# Altium project PCB_Project.PrjPcb
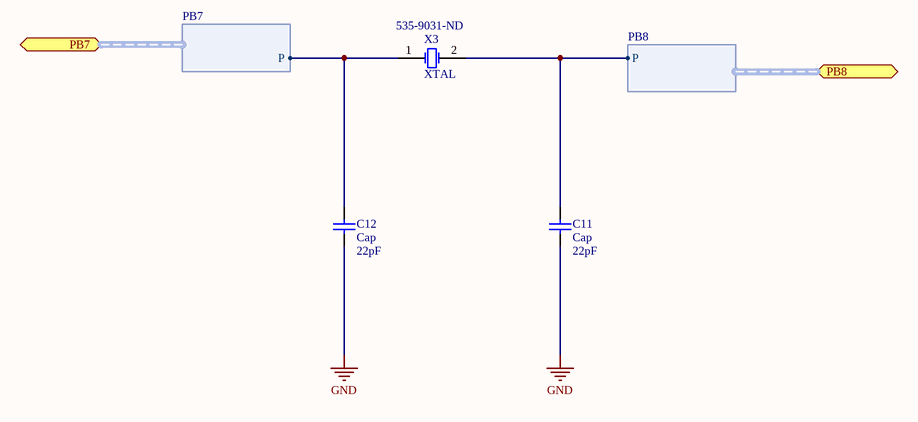
[diagram p0: crystal_oscillator_low_freq.SchDoc]
6 sheets, 32 parts. Net scope: flat (ports and power ports of the same name join across sheets).
Board files: PCB3.PcbDoc, PCB2.PcbDoc, PCB1.PcbDoc
Sheets:
  crystal_oscillator_low_freq.SchDoc
  crystal_oscillator_high_freq.SchDoc
  Power Supply.SchDoc
  USB.SchDoc
  Serial Wire Debug.SchDoc
  MCU.SchDoc

## Sheet crystal_oscillator_low_freq.SchDoc
size A4

### Parts
C11  Cap  value 22pF  [RAD-0.3]
C12  Cap  value 22pF  [RAD-0.3]
X3  XTAL  Supplier Part Number 1: 535-9031-ND  [R38]

### Ports
PB7 (harness PB7), PB8 (harness PB8)

### Harnesses
PB7: P
PB8: P

### Nets
GND: C11.1 C12.1
NetC11_2: C11.2 X3.2(OSC2) ; port PB8.P
NetC12_2: C12.2 X3.1(OSC1) ; port PB7.P

### Library data of the parts
C11 C12 = Cap: Capacitor; Published: 8-Jun-2000; LatestRevisionDate: 17-Jul-2002; LatestRevisionNote: Re-released for DXP Platform.; PackageReference: RAD-0.3; Publisher: Altium Limited; PackageDescription: Radial Cap, Thru-Hole; 2 Leads; 0.3 in Pin Spacing
X3 = XTAL: Crystal Oscillator; Manufacturer: Abracon Corporation; Manufacturer Part Number: AB15T-32.768KHZ; Description: CRYSTAL 32.768KHZ 12.5PF THRU; Frequency: 32.768kHz; Frequency Tolerance: ±20ppm; Load Capacitance: 12.5pF; ESR (Equivalent Series Resistance): 40 kOhm; Operating Mode: Fundamental; Published: 8-Jun-2000; LatestRevisionDate: 17-Jul-2002; LatestRevisionNote: Re-released for DXP Platform.; PackageReference: R38; Publisher: Altium Limited; PackageDescription: Crystal, Thru-Hole; 2 Leads; Body 3.1 x 8.2 mm (Dia.xH); Supplier 1: Digi-Key; RoHS: RoHS Compliant; Category: Crystals and Oscillators; Stock 1: 860; Pricing 1: 1=0.94, 10=0.896, 50=0.8754, 100=0.7504, 500=0.72958, 750=0.66704, 1000=0.61493, 2500=0.58366, 5000=0.56282 (EUR); Packaging: Bulk; Type: kHz Crystal (Tuning Fork); Frequency Stability: -; Operating Temperature: -20°C ~ 70°C; Ratings: -; Mounting Type: Through Hole; Package / Case: Cylindrical Can, Radial; Size / Dimension: 0.055" Dia x 0.197" L (1.40mm x 5.00mm); Height: 0.201" (5.10mm); ComponentLink1URL: http://www.abracon.com/Resonators/AB15T.pdf; ComponentLink1Description: http://www.abracon.com/Resonators/AB15T.pdf

## Sheet crystal_oscillator_high_freq.SchDoc
size A4
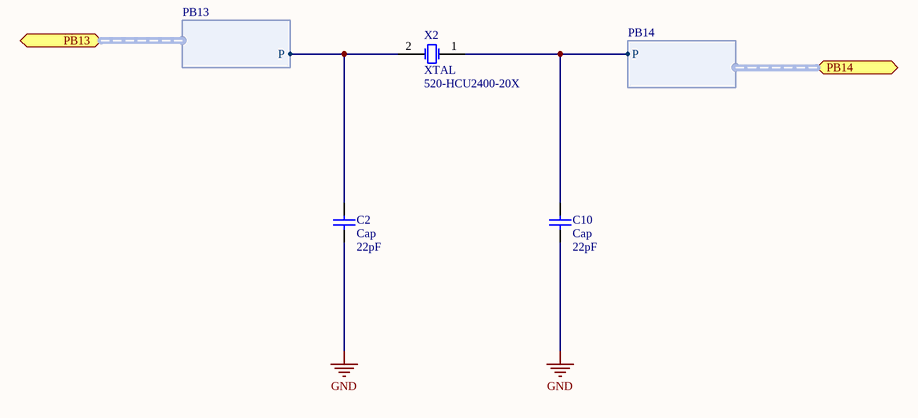
[diagram p1: crystal_oscillator_high_freq.SchDoc]

### Parts
C2  Cap  value 22pF  [RAD-0.3]
C10  Cap  value 22pF  [RAD-0.3]
X2  XTAL  Supplier Part Number 1: 520-HCU2400-20X  [R38]

### Ports
PB13 (harness PB13), PB14 (harness PB14)

### Harnesses
PB13: P
PB14: P

### Nets
GND: C2.1 C10.1
NetC2_2: C2.2 X2.2(OSC2) ; port PB13.P
NetC10_2: C10.2 X2.1(OSC1) ; port PB14.P

### Library data of the parts
C2 C10 = Cap: Capacitor; Published: 8-Jun-2000; LatestRevisionDate: 17-Jul-2002; LatestRevisionNote: Re-released for DXP Platform.; PackageReference: RAD-0.3; Publisher: Altium Limited; PackageDescription: Radial Cap, Thru-Hole; 2 Leads; 0.3 in Pin Spacing
X2 = XTAL: Crystal Oscillator; Manufacturer: ECS; Manufacturer Part Number: ECS-240-20-4X; Description: Crystals 24MHz 20pF; Frequency: 24 MHz; Frequency Stability: 50 PPM; Load Capacitance: 20 pF; Tolerance: 30 PPM; Published: 8-Jun-2000; LatestRevisionDate: 17-Jul-2002; LatestRevisionNote: Re-released for DXP Platform.; PackageReference: R38; Publisher: Altium Limited; PackageDescription: Crystal, Thru-Hole; 2 Leads; Body 3.1 x 8.2 mm (Dia.xH); Supplier 1: Mouser; RoHS: RoHS Compliant; Category: Crystals; Stock 1: 5884; Pricing 1: 1=0.716, 10=0.635, 100=0.558, 500=0.497, 1000=0.435, 2000=0.402 (AUD); Dimensions: 4.65 mm W x 11.35 mm L x 3.5 mm H; Operating Temperature Range: - 10 C to + 70 C; Package / Case: HC-49/US; Packaging: Bulk; Series: HCS49USX; Termination Style: Radial; Type: Quartz Crystals; Brand: ECS; Mounting Style: Through Hole; Product Category: HC-49/U-S Microprocessor Crystals; Standard Pack Qty: 200; RoHS - Mouser: Y; Minimum Order Quantity: 1; Reeling: False; ComponentLink1URL: http://www.ecsxtal.com/store/pdf/hc-49usx.pdf; ComponentLink1Description: http://www.ecsxtal.com/store/pdf/hc-49usx.pdf

## Sheet Power Supply.SchDoc
size A4
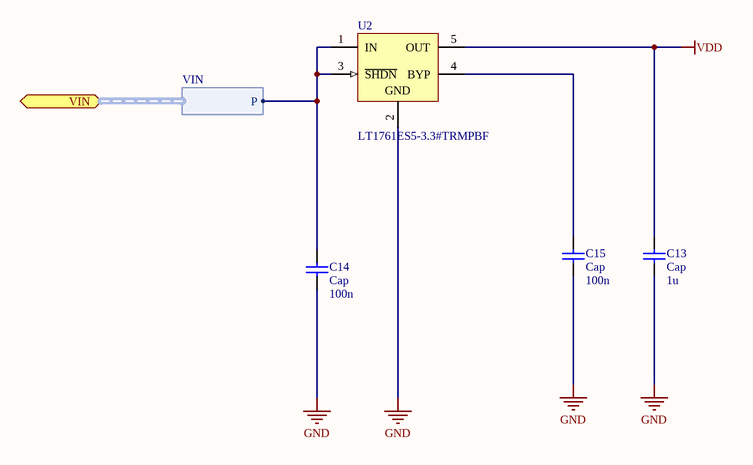
[diagram p2: Power Supply.SchDoc]

### Parts
C13  Cap  value 1u  [RAD-0.3]
C14  Cap  value 100n  [RAD-0.3]
C15  Cap  value 100n  [RAD-0.3]
U2  LT1761ES5-3.3#TRMPBF  [LT-S5-5-TSOT-23_N]

### Ports
VIN (harness VIN)

### Harnesses
VIN: P

### Nets
GND: C13.1 C14.1 C15.1 U2.2(GND)
VDD: C13.2 U2.5(OUT)
NetC14_2: C14.2 U2.1(IN) U2.3(~{SHDN}) ; port VIN.P
NetC15_2: C15.2 U2.4(BYP)

### Library data of the parts
C13-C15 = Cap: Capacitor; Published: 8-Jun-2000; LatestRevisionDate: 17-Jul-2002; LatestRevisionNote: Re-released for DXP Platform.; PackageReference: RAD-0.3; Publisher: Altium Limited; PackageDescription: Radial Cap, Thru-Hole; 2 Leads; 0.3 in Pin Spacing
U2 = CMP-0476-01224-1: 100 mA, Low Noise, LDO Micropower Regulator, 1.8 to 20 V Vin, 3.3 V Vout, 5-pin SOT23 (S5-5), -40 to 125 degC, Pb-Free, Mini Tape and Reel; Manufacturer: Linear Technology; Number of Outputs: 1; Iout(mA): 100; Isupply(mA): 0.02; Dropout Voltage(V): 0.3; Noise(uV): 20; PSRR(dB): 65; Discrete Pass Element: no; Vin Min(V): 1.8; Output Voltage: 3.3 V; Code_JEDEC: MO-193; Mounting Technology: Surface Mount; ComponentLink2Description: Datasheet; PackageReference: S5-5; PackageVersion: Jun-10; ComponentLink1Description: Manufacturer URL; ComponentLink3URL: http://cds.linear.com/docs/en/packaging/SOT_5_05-08-1635.pdf; RoHS: TRUE; ComponentLink3Description: Package Specification; Shutdown Current(uA): 1; ComponentLink1URL: http://www.linear.com/; Vin Max(V): 20; PackageDescription: 5-Pin Plastic TSOT-23, Body 1.63 x 2.90 mm, Pitch 0.95 mm; PartNumber: LT1761ES5-3.3#TRMPBF; DatasheetVersion: Rev. F; Packing: Mini Tape and Reel; ComponentLink2URL: http://cds.linear.com/docs/en/datasheet/1761sff.pdf

## Sheet USB.SchDoc
size A4
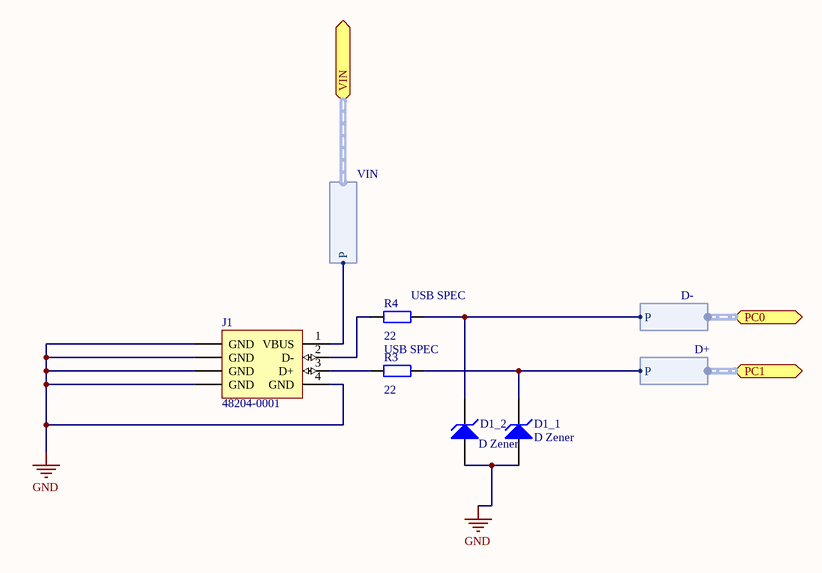
[diagram p3: USB.SchDoc]

### Parts
D1_1  D Zener  [DIODE-0.7]
D1_2  D Zener  [DIODE-0.7]
J1  48204-0001  [MOLX-48204-0001_V]
R3  USB SPEC  value 22  [AXIAL-0.4]
R4  USB SPEC  value 22  [AXIAL-0.4]

### Ports
PC0 (harness D-), PC1 (harness D+), VIN (harness VIN)

### Harnesses
VIN: P
D-: P
D+: P

### Nets
GND: D1_1.1(A) D1_2.1(A) J1.4(GND) J1.5(GND) J1.6(GND) J1.7(GND) J1.8(GND)
NetC14_2: J1.1(VBUS) ; port VIN.P
NetD1_1_2: D1_1.2(K) R3.2 ; port PC1.P
NetD1_2_2: D1_2.2(K) R4.2 ; port PC0.P
NetJ1_2: J1.2(D-) R4.1
NetJ1_3: J1.3(D+) R3.1

### Library data of the parts
D1_1 D1_2 = D Zener: Zener Diode; Published: 8-Jun-2000; LatestRevisionDate: 17-Jul-2002; LatestRevisionNote: Re-released for DXP Platform.; PackageReference: DIODE-0.7; Publisher: Altium Limited; PackageDescription: Diode, Thru-Hole; 2 Leads; 0.7 in Pin Spacing
J1 = CMP-0411-00001-1: USB Shielded I/O Receptacle, Type A; Manufacturer: Molex; Required PB Thickness: 1.6 mm; ComponentLink1URL: http://www.molex.com/; PackageDescription: USB Type-A Up-Right Reverse Connector; PartNumber: 48204-0001; DatasheetVersion: Rev D, 04/2006; Contact Finish: Bronze; PackageReference: 48204-0001; Mounting Technology: Through Hole; ComponentLink2Description: Datasheet; ComponentLink1Description: Manufacturer URL; ComponentLink2URL: http://www.molex.com/pdm_docs/sd/482040001_sd.pdf
R3 R4 = Res2: Resistor; Published: 8-Jun-2000; LatestRevisionDate: 17-Jul-2002; LatestRevisionNote: Re-released for DXP Platform.; PackageReference: AXIAL-0.4; Publisher: Altium Limited; PackageDescription: Axial Device, Thru-Hole; 2 Leads; 0.4 in Pin Spacing

## Sheet Serial Wire Debug.SchDoc
size A4
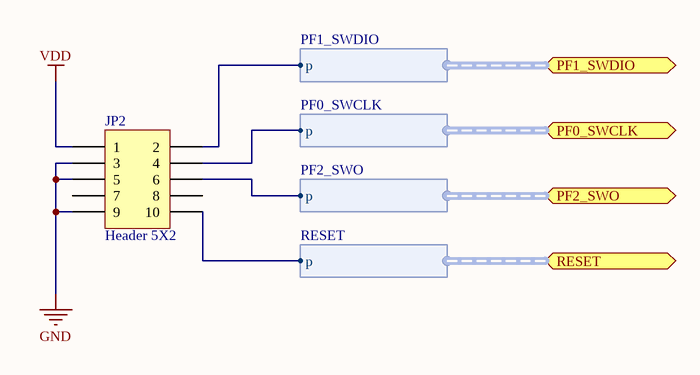
[diagram p4: Serial Wire Debug.SchDoc]

### Parts
JP2  Header 5X2  [HDR2X5]

### Ports
PF0_SWCLK (harness PF0_SWCLK), PF1_SWDIO (harness PF1_SWDIO), PF2_SWO (harness PF2_SWO), RESET (harness RESET)

### Harnesses
PF1_SWDIO: p
PF0_SWCLK: p
PF2_SWO: p
RESET: p

### Nets
GND: JP2.3 JP2.5 JP2.9
VDD: JP2.1
NetJP1_7: JP2.10 ; port RESET.p
NetJP2_2: JP2.2 ; port PF1_SWDIO.p
NetJP2_4: JP2.4 ; port PF0_SWCLK.p
NetJP2_6: JP2.6 ; port PF2_SWO.p

Not connected (* = marked no-connect by the designer): JP2 7 8

### Library data of the parts
JP2 = Header 5X2: Header, 5-Pin, Dual row; LatestRevisionDate: 17-Jul-2002; LatestRevisionNote: Re-released for DXP Platform.; Publisher: Altium Limited

## Sheet MCU.SchDoc
size A4
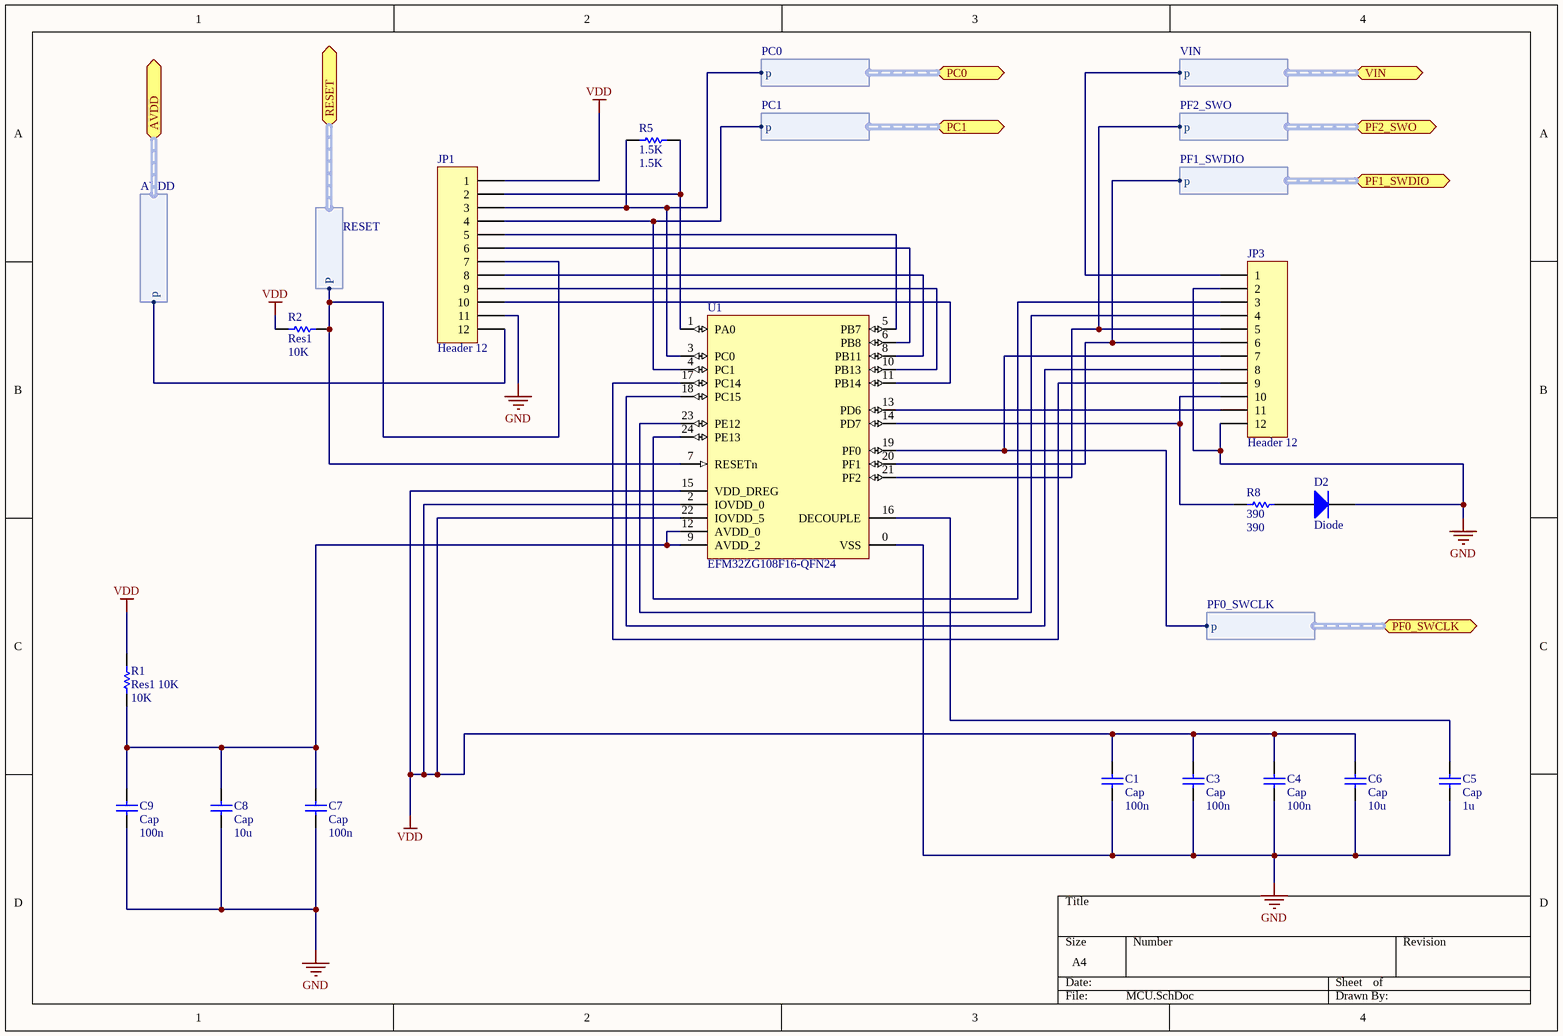
[diagram p5: MCU.SchDoc]

### Parts
C1  Cap  value 100n  [RAD-0.3]
C3  Cap  value 100n  [RAD-0.3]
C4  Cap  value 100n  [RAD-0.3]
C5  Cap  value 1u  [RAD-0.3]
C6  Cap  value 10u  [RAD-0.3]
C7  Cap  value 100n  [RAD-0.3]
C8  Cap  value 10u  [RAD-0.3]
C9  Cap  value 100n  [RAD-0.3]
D2  Diode  [SMC]
JP1  Header 12  [HDR1X12]
JP3  Header 12  [HDR1X12]
R1  Res1 10K  value 10K  [AXIAL-0.3]
R2  Res1  value 10K  [AXIAL-0.3]
R5  1.5K  [AXIAL-0.3]
R8  390  [AXIAL-0.3]
U1  EFM32ZG108F16-QFN24  [ENMR-QFN24_M]

### Ports
AVDD (harness AVDD), PC0 (harness PC0), PC1 (harness PC1), PF0_SWCLK (harness PF0_SWCLK), PF1_SWDIO (harness PF1_SWDIO), PF2_SWO (harness PF2_SWO), RESET (harness RESET), VIN (harness VIN)

### Harnesses
RESET: P
AVDD: p
PF0_SWCLK: p
VIN: p
PF2_SWO: p
PF1_SWDIO: p
PC0: p
PC1: p

### Nets
GND: C1.1 C3.1 C4.1 C5.1 C6.1 C7.1 C8.1 C9.1 D2.2(K) JP1.11 JP3.2 JP3.12 U1.0(VSS)
VDD: C1.2 C3.2 C4.2 C6.2 JP1.1 R1.2 R2.2 U1.2(IOVDD_0) U1.15(VDD_DREG) U1.22(IOVDD_5)
NetC5_2: C5.2 U1.16(DECOUPLE)
NetC7_2: C7.2 C8.2 C9.2 R1.1 U1.9(AVDD_2) U1.12(AVDD_0)
NetC14_2: JP3.1 ; port VIN.p
NetD1_1_2: JP1.4 U1.4(PC1) ; port PC1.p
NetD1_2_2: JP1.3 R5.1 U1.3(PC0) ; port PC0.p
NetD2_1: D2.1(A) R8.2
NetJP1_2: JP1.2 R5.2 U1.1(PA0)
NetJP1_5: JP1.5 U1.5(PB7)
NetJP1_6: JP1.6 U1.6(PB8)
NetJP1_7: JP1.7 R2.1 U1.7(RESETn) ; port RESET.P
NetJP1_8: JP1.8 U1.8(PB11)
NetJP1_9: JP1.9 U1.10(PB13)
NetJP1_10: JP1.10 U1.11(PB14)
NetJP1_12: JP1.12 ; port AVDD.p
NetJP2_2: JP3.6 U1.20(PF1) ; port PF1_SWDIO.p
NetJP2_4: JP3.7 U1.19(PF0) ; port PF0_SWCLK.p
NetJP2_6: JP3.5 U1.21(PF2) ; port PF2_SWO.p
NetJP3_3: JP3.3 U1.24(PE13)
NetJP3_4: JP3.4 U1.23(PE12)
NetJP3_8: JP3.8 U1.18(PC15)
NetJP3_9: JP3.9 U1.17(PC14)
NetJP3_10: JP3.10 R8.1 U1.14(PD7)
NetJP3_11: JP3.11 U1.13(PD6)

### Library data of the parts
C1 C3-C9 = Cap: Capacitor; Published: 8-Jun-2000; LatestRevisionDate: 17-Jul-2002; LatestRevisionNote: Re-released for DXP Platform.; PackageReference: RAD-0.3; Publisher: Altium Limited; PackageDescription: Radial Cap, Thru-Hole; 2 Leads; 0.3 in Pin Spacing
D2 = Diode: Default Diode; Published: 8-Jun-2000; LatestRevisionDate: 17-Jul-2002; LatestRevisionNote: Re-released for DXP Platform.; PackageVersion: Sep-1996; PackageReference: SMC; Publisher: Altium Limited; PackageDescription: DO-214-AB/SMC; 2 C-Bend Leads; Body 7.9 x 5.9 mm, inc. leads (LxW); Code_JEDEC: DO-214-AB
JP1 JP3 = Header 12: Header, 12-Pin; LatestRevisionDate: 17-Jul-2002; LatestRevisionNote: Re-released for DXP Platform.; Publisher: Altium Limited
R1 R2 R5 R8 = Res1: Resistor; Published: 8-Jun-2000; LatestRevisionDate: 17-Jul-2002; LatestRevisionNote: Re-released for DXP Platform.; PackageReference: AXIAL-0.3; Publisher: Altium Limited; PackageDescription: Axial Device, Thru-Hole; 2 Leads; 0.3 in Pin Spacing
  R5: Value: 1.5K
  R8: Value: 390
U1 = CMP-0270-00117-1: EFM32 Zero Gecko, M0+ ARM Cortex CPU, 16 KB Flash, 4 KB RAM, 1.85 - 3.8 V Supply, 32 MHz Max Speed, -40 to 85 degC, 24-Pin QFN, RoHS Compliant; Flash (KB): 16; RAM (KB): 4; GPIO: 17; USART/SPI (I2S): 1 (1); I2C: 1; Max Speed (MHz): 32; ComponentLink3Description: Package Specification; Subcategory: EFM32 Zero Gecko; PackageDescription: 24-Pin Quad Flat No-lead Package, Body 5.0 x 5.0 mm, Pitch 0.65 mm; PackageReference: QFN24; Mounting Technology: Surface Mount; Supply Voltage (V): 1.85 - 3.8; DatasheetVersion: Rev 0.40; ComponentLink1Description: Manufacturer URL; ComponentLink1URL: http://www.energymicro.com/; PartNumber: EFM32ZG108F16-QFN24; ARM Cortex CPU: M0+; ComponentLink2Description: Datasheet; PackageVersion: Rev. 98SPP24076A_XO2_25MAR2011; ComponentLink2URL: http://cdn.energymicro.com/dl/devices/pdf/d0063_efm32zg108_datasheet.pdf; Generic Part Number: EFM32ZG108; ComponentLink3URL: http://cdn.energymicro.com/dl/devices/pdf/d0032_efm32tg108_datasheet.pdf

## Nets that join several sheets
GND: crystal_oscillator_low_freq (C11.1 C12.1), crystal_oscillator_high_freq (C2.1 C10.1), Power Supply (C13.1 C14.1 C15.1 U2.2), USB (7 pins), Serial Wire Debug (JP2.3 JP2.5 JP2.9), MCU (13 pins)
VDD: Power Supply (C13.2 U2.5), Serial Wire Debug (JP2.1), MCU (10 pins)
NetC14_2: Power Supply (C14.2 U2.1 U2.3), USB (J1.1), MCU (JP3.1)
NetD1_1_2: USB (D1_1.2 R3.2), MCU (JP1.4 U1.4)
NetD1_2_2: USB (D1_2.2 R4.2), MCU (JP1.3 R5.1 U1.3)
NetJP1_7: Serial Wire Debug (JP2.10), MCU (JP1.7 R2.1 U1.7)
NetJP2_2: Serial Wire Debug (JP2.2), MCU (JP3.6 U1.20)
NetJP2_4: Serial Wire Debug (JP2.4), MCU (JP3.7 U1.19)
NetJP2_6: Serial Wire Debug (JP2.6), MCU (JP3.5 U1.21)